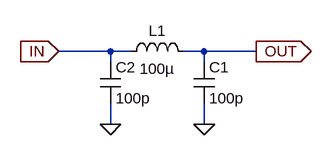
[diagram p0: schematic PIsection.asc]
PIsection.asc, the LTspice schematic file:
Version 4
SHEET 1 880 680
WIRE 192 160 112 160
WIRE 224 160 192 160
WIRE 336 160 304 160
WIRE 416 160 336 160
WIRE 192 176 192 160
WIRE 336 176 336 160
WIRE 192 272 192 240
WIRE 336 272 336 240
FLAG 192 272 0
FLAG 336 272 0
FLAG 112 160 IN
IOPIN 112 160 In
FLAG 416 160 OUT
IOPIN 416 160 Out
SYMBOL ind 208 176 R270
WINDOW 0 32 56 VTop 0
WINDOW 3 5 56 VBottom 0
SYMATTR InstName L1
SYMATTR Value 100µ
SYMBOL cap 320 176 R0
SYMATTR InstName C1
SYMATTR Value 100p
SYMBOL cap 176 176 R0
SYMATTR InstName C2
SYMATTR Value 100p

The netlist it stands for:
* PIsection.asc
L1 IN OUT 100µ
C1 OUT 0 100p
C2 IN 0 100p
.backanno
.end